# EAGLE design PCB (EAGLE 9.1.0)
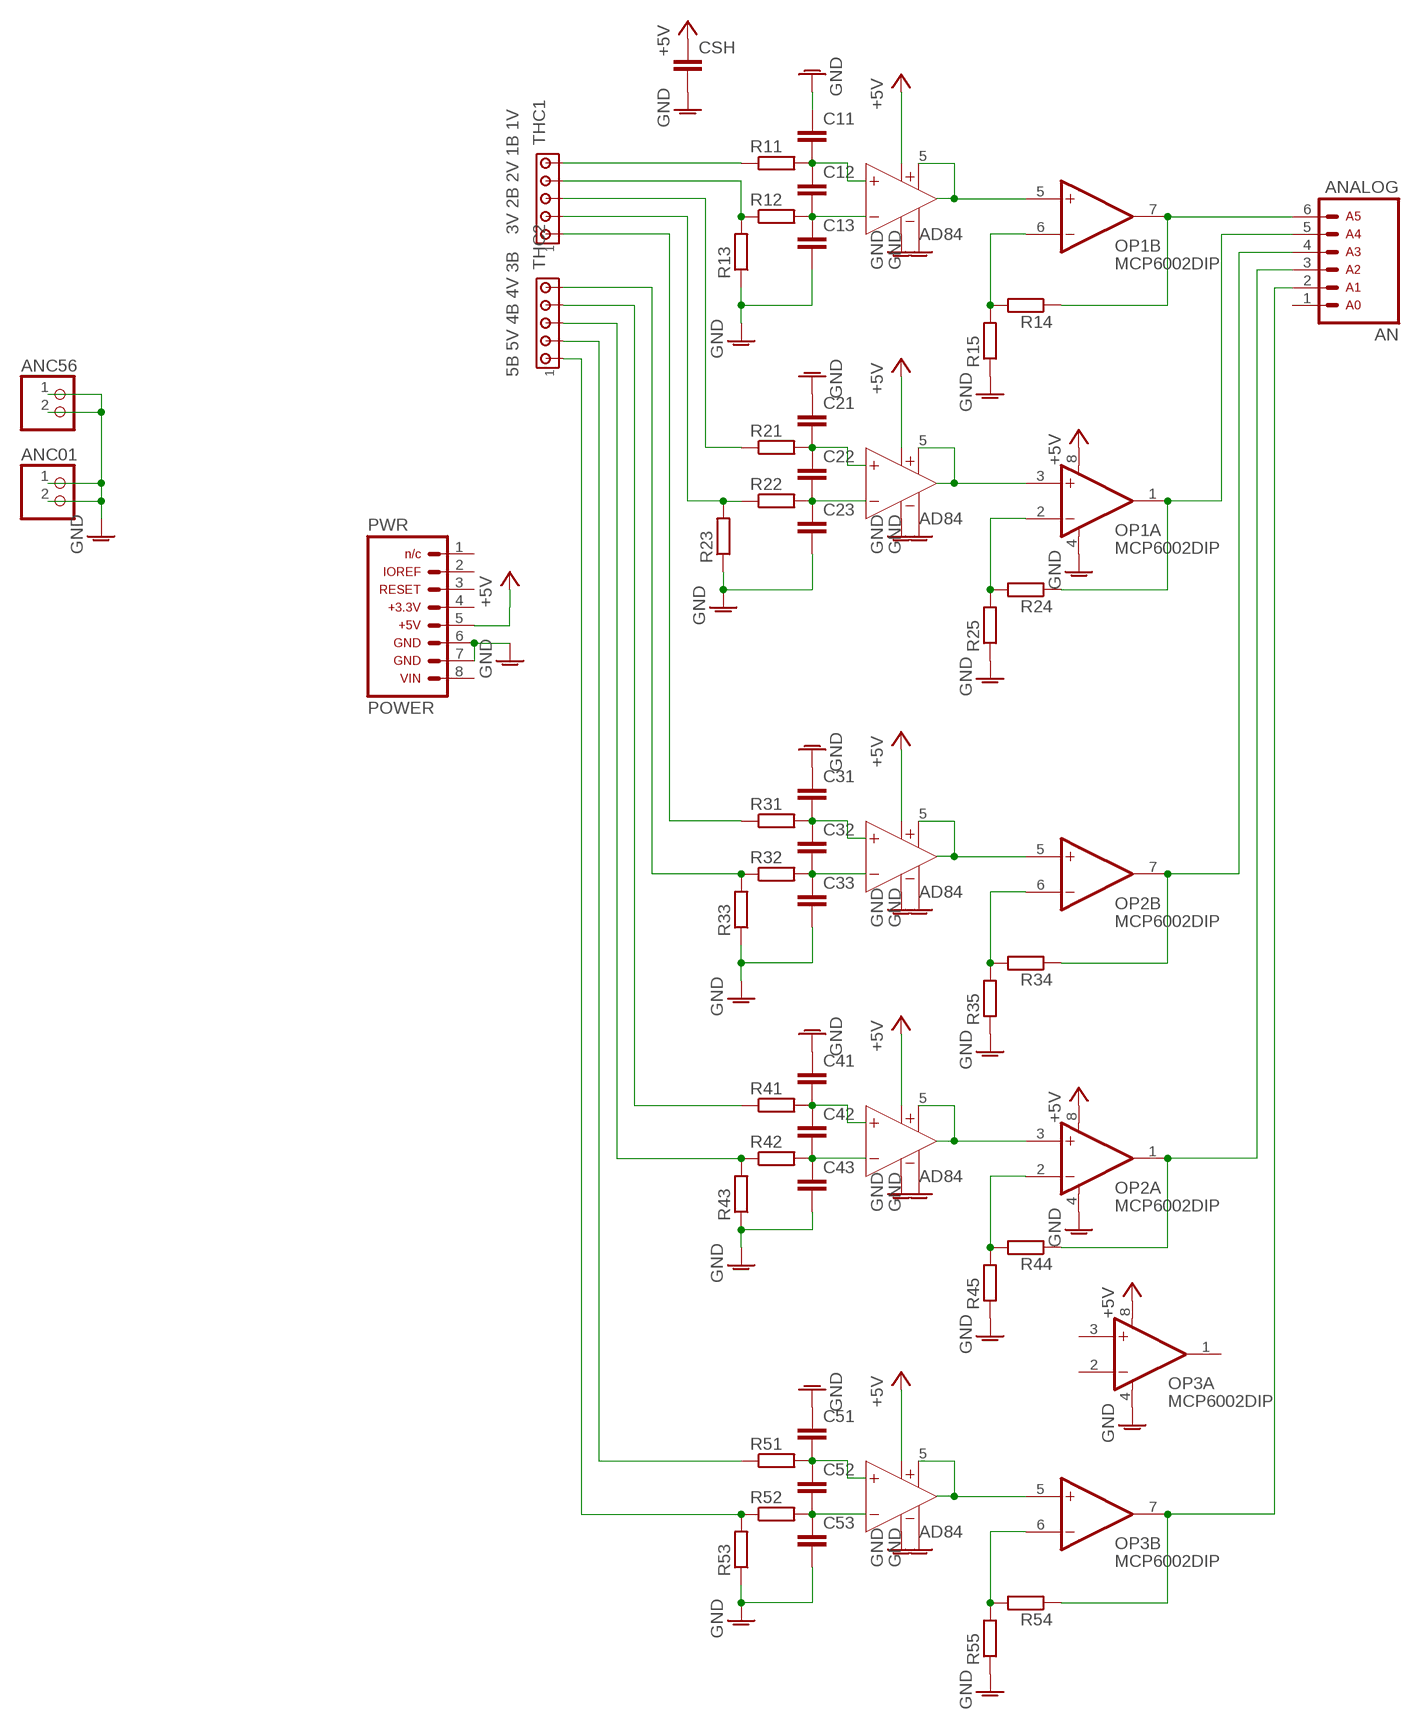
[diagram p0: schematic, sheet 1]

## Parts
AN  ARDUINO_CONN-ANALOGSIP  [CONN-1X06]
ANC01  PINHD-1X2  [1X02]
ANC56  PINHD-1X2  [1X02]
C11  C-EU050-025X075  [C050-025X075]
C12  C-EU050-025X075  [C050-025X075]
C13  C-EU050-025X075  [C050-025X075]
C21  C-EU050-025X075  [C050-025X075]
C22  C-EU050-025X075  [C050-025X075]
C23  C-EU050-025X075  [C050-025X075]
C31  C-EU050-025X075  [C050-025X075]
C32  C-EU050-025X075  [C050-025X075]
C33  C-EU050-025X075  [C050-025X075]
C41  C-EU050-025X075  [C050-025X075]
C42  C-EU050-025X075  [C050-025X075]
C43  C-EU050-025X075  [C050-025X075]
C51  C-EU050-025X075  [C050-025X075]
C52  C-EU050-025X075  [C050-025X075]
C53  C-EU050-025X075  [C050-025X075]
CSH  C-EU050-025X075  [C050-025X075]
OP1  MCP6002DIP  [DIP-8]
OP2  MCP6002DIP  [DIP-8]
OP3  MCP6002DIP  [DIP-8]
PWR  ARDUINO_CONN-POWERSIP  [CONN-1X08]
R11  R-EU_0207/10  [0207/10]
R12  R-EU_0207/10  [0207/10]
R13  R-EU_0207/10  [0207/10]
R14  R-EU_0207/10  [0207/10]
R15  R-EU_0207/10  [0207/10]
R21  R-EU_0207/10  [0207/10]
R22  R-EU_0207/10  [0207/10]
R23  R-EU_0207/10  [0207/10]
R24  R-EU_0207/10  [0207/10]
R25  R-EU_0207/10  [0207/10]
R31  R-EU_0207/10  [0207/10]
R32  R-EU_0207/10  [0207/10]
R33  R-EU_0207/10  [0207/10]
R34  R-EU_0207/10  [0207/10]
R35  R-EU_0207/10  [0207/10]
R41  R-EU_0207/10  [0207/10]
R42  R-EU_0207/10  [0207/10]
R43  R-EU_0207/10  [0207/10]
R44  R-EU_0207/10  [0207/10]
R45  R-EU_0207/10  [0207/10]
R51  R-EU_0207/10  [0207/10]
R52  R-EU_0207/10  [0207/10]
R53  R-EU_0207/10  [0207/10]
R54  R-EU_0207/10  [0207/10]
R55  R-EU_0207/10  [0207/10]
THC1  3V 2B 2V 1B 1V  MTA05-100  [10X05MTA]
THC2  5B 5V 4B 4V 3B  MTA05-100  [10X05MTA]
U$1  AD84  [DIP-8]
U$2  AD84  [DIP-8]
U$3  AD84  [DIP-8]
U$4  AD84  [DIP-8]
U$5  AD84  [DIP-8]

## Nets
+5V: CSH.1 OP1.8(A:V+) OP2.8(A:V+) OP3.8(A:V+) PWR.5 U$1.7(V+) U$2.7(V+) U$3.7(V+) U$4.7(V+) U$5.7(V+)
GNDA: ANC01.1 ANC01.2 ANC56.1 ANC56.2 C11.1 C13.2 C21.1 C23.2 C31.1 C33.2 C41.1 C43.2 C51.1 C53.2 CSH.2 OP1.4(A:V-) OP2.4(A:V-) OP3.4(A:V-) PWR.6 PWR.7 R13.1 R15.1 R23.1 R25.1 R33.1 R35.1 R43.1 R45.1 R53.1 R55.1 U$1.2(REF) U$1.3(V-) U$2.2(REF) U$2.3(V-) U$3.2(REF) U$3.3(V-) U$4.2(REF) U$4.3(V-) U$5.2(REF) U$5.3(V-) ; supply symbol labelled GND
N$1: OP1.5(B:+IN) U$1.5(SENS) U$1.6(OUT)
N$2: AN.6 OP1.7(B:OUT) R14.1
N$3: OP1.6(B:-IN) R14.2 R15.2
N$6: C11.2 C12.1 R11.2 U$1.8(IN+)
N$7: R12.1 R13.2 THC1.4
N$8: C12.2 C13.1 R12.2 U$1.1(IN-)
N$9: R22.1 R23.2 THC1.2
N$10: R32.1 R33.2 THC2.5
N$11: OP1.2(A:-IN) R24.2 R25.2
N$12: C21.2 C22.1 R21.2 U$2.8(IN+)
N$13: C22.2 C23.1 R22.2 U$2.1(IN-)
N$14: AN.5 OP1.1(A:OUT) R24.1
N$16: OP1.3(A:+IN) U$2.5(SENS) U$2.6(OUT)
N$17: OP2.5(B:+IN) U$3.5(SENS) U$3.6(OUT)
N$18: OP2.6(B:-IN) R34.2 R35.2
N$19: C31.2 C32.1 R31.2 U$3.8(IN+)
N$20: C32.2 C33.1 R32.2 U$3.1(IN-)
N$21: AN.4 OP2.7(B:OUT) R34.1
N$23: R42.1 R43.2 THC2.3
N$24: OP2.2(A:-IN) R44.2 R45.2
N$25: C41.2 C42.1 R41.2 U$4.8(IN+)
N$26: C42.2 C43.1 R42.2 U$4.1(IN-)
N$27: AN.3 OP2.1(A:OUT) R44.1
N$29: OP2.3(A:+IN) U$4.5(SENS) U$4.6(OUT)
N$30: R52.1 R53.2 THC2.1
N$31: OP3.5(B:+IN) U$5.5(SENS) U$5.6(OUT)
N$32: OP3.6(B:-IN) R54.2 R55.2
N$33: C51.2 C52.1 R51.2 U$5.8(IN+)
N$34: C52.2 C53.1 R52.2 U$5.1(IN-)
N$35: AN.2 OP3.7(B:OUT) R54.1
N$37: R11.1 THC1.5
N$38: R21.1 THC1.3
N$39: R31.1 THC1.1
N$40: R41.1 THC2.4
N$42: R51.1 THC2.2
Unconnected: AN.1 OP3.1(A:OUT) OP3.2(A:-IN) OP3.3(A:+IN) PWR.1 PWR.2 PWR.3 PWR.4 PWR.8

## Library data of the parts
AN = arduino_jw:ARDUINO_CONN-ANALOG: Arduino Analog I/O Header This is the analog I/O header on the Arduino Uno R3. This connector is labeled with the following pin assignments: Analog 0 Analog 1 Analog 2 Analog 3 Analog 4 Analog 5 NOTE: Be sure you install this connector with the correct orientation on your PCB layout. Pin 1 has a square pad to assist with orientation.
ANC01 ANC56 = pinhead:PINHD-1X2: PIN HEADER
C11-C13 C21-C23 C31-C33 C41-C43 C51-C53 CSH = rcl:C-EU: CAPACITOR, European symbol; SPICEPREFIX: C
OP1-OP3 = adam - ics:MCP6002: Dual General Op Amp 1.8V min supply 1MHz (6V/us)
PWR = arduino_jw:ARDUINO_CONN-POWER: Arduino Power Header This is the power header on the Arduino Uno R3. This connector is labeled with the following pin assignments: n/c IO Ref RESET +3.3V +5V GND GND VIN NOTE: Be sure you install this connector with the correct orientation on your PCB layout. Pin 1 has a square pad to assist with orientation.
R11-R15 R21-R25 R31-R35 R41-R45 R51-R55 = resistor:R-EU_: RESISTOR, European symbol
THC1 THC2 = con-amp:MTA05-100: AMP connector
U$1-U$5 = IPS:AD84

## Board
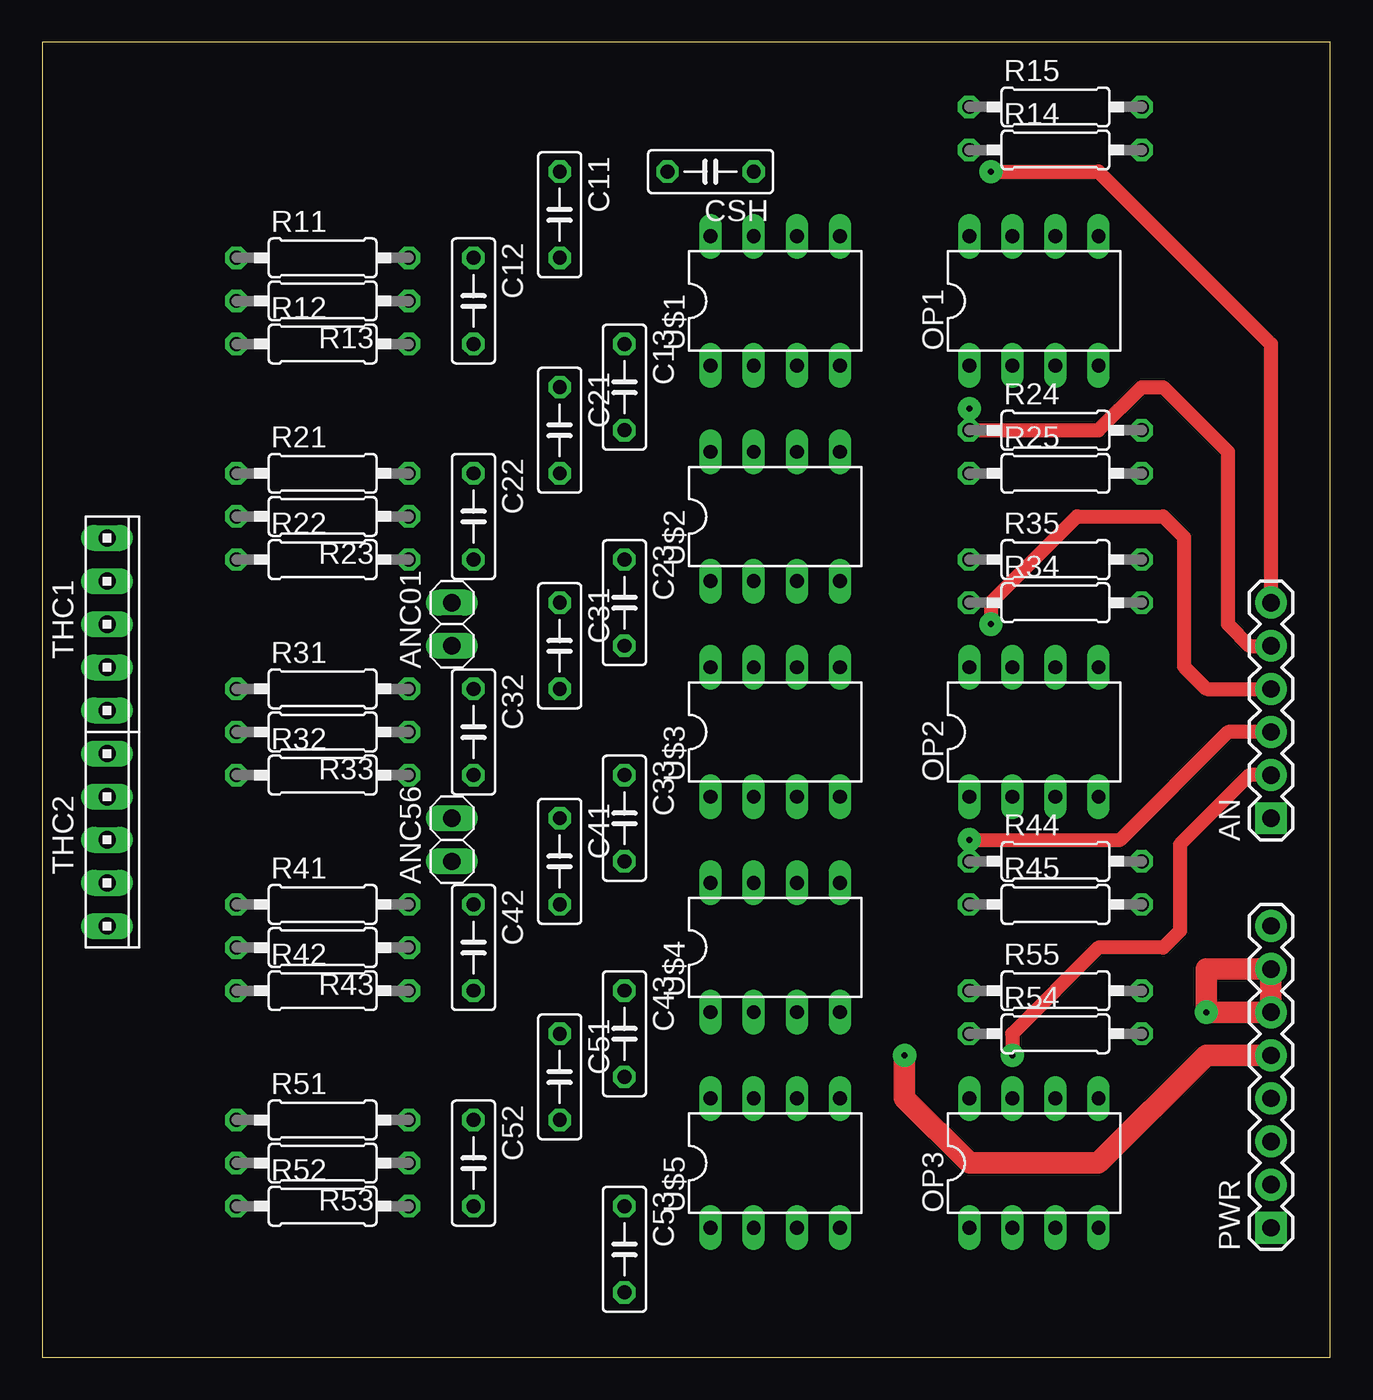
[diagram p1: board, top side]
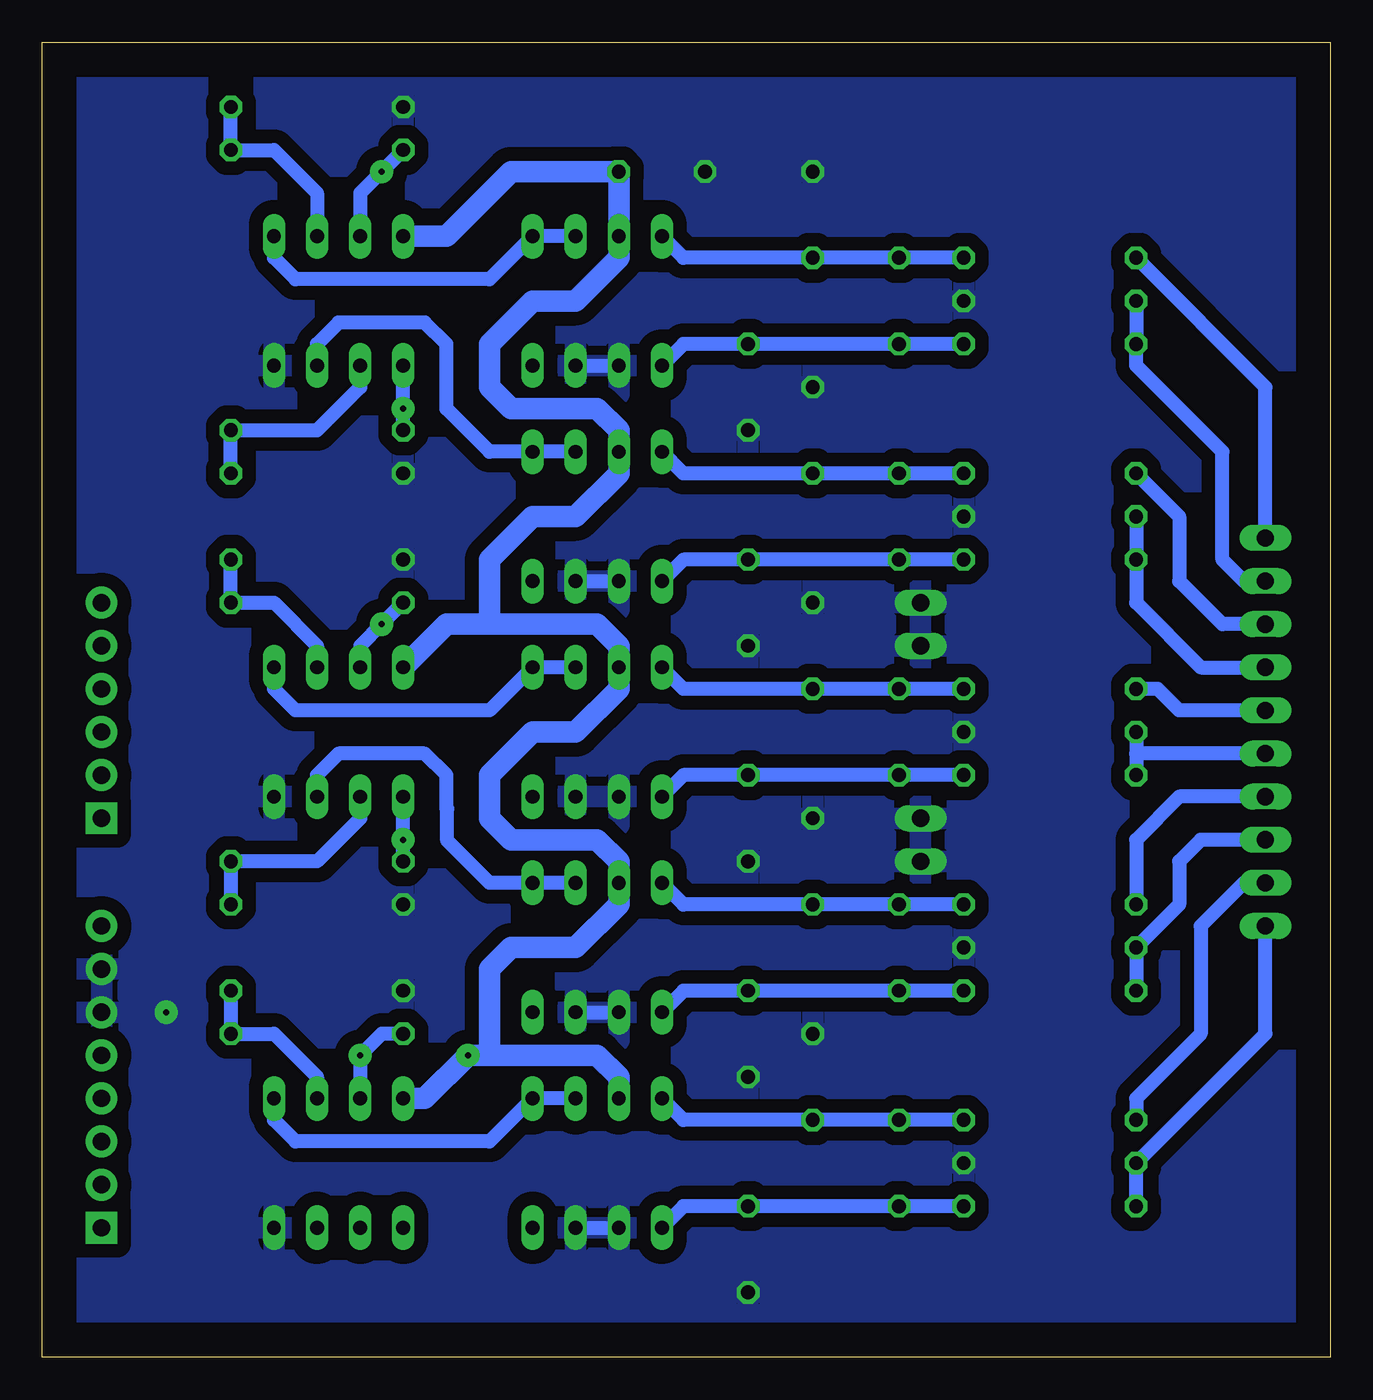
[diagram p2: board, bottom side, seen from below]

Size 75.87 x 77.46 mm. Coordinates in mm from the lower left corner, seen from the top.
Outline: 0,0 75.87,0 75.87,77.46 0,77.46 0,0
Copper layers (1*16): Top 0.035mm / dielectric 1.5mm / Bottom 0.035mm
Design rules "LBMS-ENIB": minimum track width 24mil, minimum drill 10mil, track to track 20mil, track to pad 20mil, pad to pad 20mil, via to via 20mil, smd to smd 8mil, copper to edge 80mil, drill to drill 8mil, minimum pad ring 10mil, minimum via ring 20mil, stop-mask expansion 4mil, vias tented up to drill 0mil, thermal gap 10mil

### Footprints (pad centres in the part's own frame; a part is rotated, then mirrored left to right if it is on the bottom)
CONN-1X06 = drill 1.016 pad 1.88 square: 1 0,0 | drill 1.016 pad 1.88: 2 2.54,0; 3 5.08,0; 4 7.62,0; 5 10.16,0; 6 12.7,0
1X02 = drill 1.016 long: 1 -1.27,0; 2 1.27,0
C050-025X075 = drill 0.813 octagon: 1 -2.54,0; 2 2.54,0
DIP-8 = drill 0.813 long: 1 -3.81,-3.81; 2 -1.27,-3.81; 3 1.27,-3.81; 4 3.81,-3.81; 5 3.81,3.81; 6 1.27,3.81; 7 -1.27,3.81; 8 -3.81,3.81
CONN-1X08 = drill 1.016 pad 1.88 square: 1 0,0 | drill 1.016 pad 1.88: 2 2.54,0; 3 5.08,0; 4 7.62,0; 5 10.16,0; 6 12.7,0; 7 15.24,0; 8 17.78,0
0207/10 = drill 0.813 octagon: 1 -5.08,0; 2 5.08,0
10X05MTA = drill 1.016 long: 1 5.08,0; 2 2.54,0; 3 0,0; 4 -2.54,0; 5 -5.08,0

### Placement (x,y rotation side)
AN  72.39,31.75 90 top
ANC01  24.13,43.18 90 top
ANC56  24.13,30.48 90 top
C11  30.48,67.31 270 top
C12  25.4,62.23 270 top
C13  34.29,57.15 270 top
C21  30.48,54.61 270 top
C22  25.4,49.53 270 top
C23  34.29,44.45 270 top
C31  30.48,41.91 270 top
C32  25.4,36.83 270 top
C33  34.29,31.75 270 top
C41  30.48,29.21 270 top
C42  25.4,24.13 270 top
C43  34.29,19.05 270 top
C51  30.48,16.51 270 top
C52  25.4,11.43 270 top
C53  34.29,6.35 270 top
CSH  39.37,69.85 180 top
OP1  58.42,62.23 0 top
OP2  58.42,36.83 0 top
OP3  58.42,11.43 0 top
PWR  72.39,7.62 90 top
R11  16.51,64.77 0 top
R12  16.51,59.69 0 top
R13  16.51,62.23 180 top
R14  59.69,71.12 0 top
R15  59.69,73.66 0 top
R21  16.51,52.07 0 top
R22  16.51,46.99 0 top
R23  16.51,49.53 180 top
R24  59.69,54.61 0 top
R25  59.69,52.07 0 top
R31  16.51,39.37 0 top
R32  16.51,34.29 0 top
R33  16.51,36.83 180 top
R34  59.69,44.45 0 top
R35  59.69,46.99 0 top
R41  16.51,26.67 0 top
R42  16.51,21.59 0 top
R43  16.51,24.13 180 top
R44  59.69,29.21 0 top
R45  59.69,26.67 0 top
R51  16.51,13.97 0 top
R52  16.51,8.89 0 top
R53  16.51,11.43 180 top
R54  59.69,19.05 0 top
R55  59.69,21.59 0 top
THC1  3.81,43.18 270 top
THC2  3.81,30.48 270 top
U$1  43.18,62.23 0 top
U$2  43.18,49.53 0 top
U$3  43.18,36.83 0 top
U$4  43.18,24.13 0 top
U$5  43.18,11.43 0 top

### Tracks (layer width: path | path; a pad name or v marks a point on that pad's centre or on a via)
+5V  (via drill 0.35)
  Top 1.27: v50.8,17.78 50.8,15.24 54.61,11.43 62.23,11.43 68.58,17.78 PWR.5
  Bottom 1.27: U$5.7 41.91,16.51 43.18,17.78 49.53,17.78 | 49.53,17.78 v50.8,17.78 53.34,15.24 OP3.8 | 49.53,17.78 49.53,22.86 48.26,24.13 44.45,24.13 41.91,26.67 U$4.7 41.91,29.21 43.18,30.48 48.26,30.48 49.53,31.75 49.53,34.29 46.99,36.83 44.45,36.83 41.91,39.37 U$3.7 41.91,41.91 43.18,43.18 49.53,43.18 | 49.53,43.18 49.53,46.99 46.99,49.53 44.45,49.53 41.91,52.07 U$2.7 41.91,54.61 43.18,55.88 48.26,55.88 49.53,57.15 49.53,59.69 46.99,62.23 44.45,62.23 41.91,64.77 U$1.7 CSH.1 48.26,69.85 52.07,66.04 OP1.8 | OP2.8 52.07,43.18 49.53,43.18
GNDA  (via drill 0.35)
  Top 1.27: PWR.7 PWR.6 v68.58,20.32 68.58,22.86 PWR.7
  Bottom 0.813: U$5.3 U$5.2 | U$4.3 U$4.2 | U$2.3 U$2.2 | U$1.3 U$1.2
  pour Bottom (isolate 0.813): 0,77.47 76.2,77.47 76.2,0 0,0
N$1
  Bottom 0.813: U$1.6 U$1.5 49.53,63.5 60.96,63.5 62.23,64.77 OP1.5
N$2  (via drill 0.35)
  Top 0.813: v55.88,69.85 62.23,69.85 72.39,59.69 AN.6
  Bottom 0.813: OP1.7 57.15,68.58 v55.88,69.85 R14.1
N$3
  Bottom 0.813: OP1.6 59.69,68.58 62.23,71.12 R14.2 R15.2
N$6
  Bottom 0.813: R11.2 C12.1 C11.2 38.1,64.77 U$1.8
N$7
  Bottom 0.813: THC1.4 5.08,45.72 6.35,46.99 6.35,53.34 11.43,58.42 R12.1 R13.2
N$8
  Bottom 0.813: R12.2 C12.2 C13.1 38.1,59.69 U$1.1
N$9
  Bottom 0.813: R23.2 R22.1 11.43,44.45 7.62,40.64 THC1.2
N$10
  Bottom 0.813: THC2.5 11.43,35.56 | 11.43,35.56 R32.1 | R33.2 11.43,35.56
N$11
  Bottom 0.813: R25.2 R24.2 59.69,54.61 57.15,57.15 OP1.2
N$12
  Bottom 0.813: R21.2 C22.1 C21.2 38.1,52.07 U$2.8
N$13
  Bottom 0.813: R22.2 C22.2 C23.1 38.1,46.99 U$2.1
N$14  (via drill 0.35)
  Top 0.813: R24.1 62.23,54.61 64.77,57.15 66.04,57.15 69.85,53.34 69.85,43.18 71.12,41.91 AN.5
  Bottom 0.813: R24.1 v54.61,55.88 OP1.1
N$16
  Bottom 0.813: U$2.6 U$2.5 49.53,53.34 52.07,55.88 52.07,59.69 53.34,60.96 58.42,60.96 59.69,59.69 OP1.3
N$17
  Bottom 0.813: U$3.6 U$3.5 49.53,38.1 60.96,38.1 62.23,39.37 OP2.5
N$18
  Bottom 0.813: R35.2 R34.2 62.23,44.45 59.69,41.91 OP2.6
N$19
  Bottom 0.813: R31.2 C32.1 C31.2 38.1,39.37 U$3.8
N$20
  Bottom 0.813: R32.2 C32.2 C33.1 38.1,34.29 U$3.1
N$21  (via drill 0.35)
  Top 0.813: v55.88,43.18 55.88,44.45 60.96,49.53 66.04,49.53 67.26,48.31 67.26,40.69 68.58,39.37 AN.4
  Bottom 0.813: R34.1 v55.88,43.18 57.15,41.91 OP2.7
N$23
  Bottom 0.813: THC2.3 7.62,30.48 8.89,29.21 8.89,26.67 R43.2 R42.1
N$24
  Bottom 0.813: OP2.2 57.15,31.75 59.69,29.21 R44.2 R45.2
N$25
  Bottom 0.813: R41.2 C42.1 C41.2 38.1,26.67 U$4.8
N$26
  Bottom 0.813: R42.2 C42.2 C43.1 38.1,21.59 U$4.1
N$27  (via drill 0.35)
  Top 0.813: v54.61,30.48 63.5,30.48 69.85,36.83 AN.3
  Bottom 0.813: R44.1 v54.61,30.48 OP2.1
N$29
  Bottom 0.813: U$4.6 U$4.5 49.53,27.94 52.02,30.43 52.02,32.3 52.07,32.35 52.07,34.29 53.34,35.56 58.42,35.56 59.69,34.29 OP2.3
N$30
  Bottom 0.813: R52.1 R53.2 3.81,19.05 THC2.1
N$31
  Bottom 0.813: U$5.6 U$5.5 49.53,12.7 60.96,12.7 62.23,13.97 OP3.5
N$32
  Bottom 0.813: R55.2 R54.2 62.23,19.05 59.69,16.51 OP3.6
N$33
  Bottom 0.813: R51.2 C52.1 C51.2 38.1,13.97 U$5.8
N$34
  Bottom 0.813: R52.2 C52.2 C53.1 38.1,8.89 U$5.1
N$35  (via drill 0.35)
  Top 0.813: AN.2 71.12,34.29 67.03,30.2 67.03,25.12 66.04,24.13 62.23,24.13 57.15,19.05 v57.15,17.78
  Bottom 0.813: OP3.7 v57.15,17.78 55.88,19.05 R54.1
N$37
  Bottom 0.813: THC1.5 3.81,57.15 R11.1
N$38
  Bottom 0.813: THC1.3 6.35,43.18 8.89,45.72 8.89,49.53 R21.1
N$39
  Bottom 0.813: THC1.1 8.89,38.1 10.16,39.37 R31.1
N$40
  Bottom 0.813: THC2.4 8.89,33.02 11.43,30.48 R41.1
N$42
  Bottom 0.813: R51.1 11.43,15.24 7.62,19.05 7.62,25.4 5.08,27.94 THC2.2